# Altium schematic sheet MCU.SchDoc
size A4; SheetNumber: 1; SheetTotal: 3
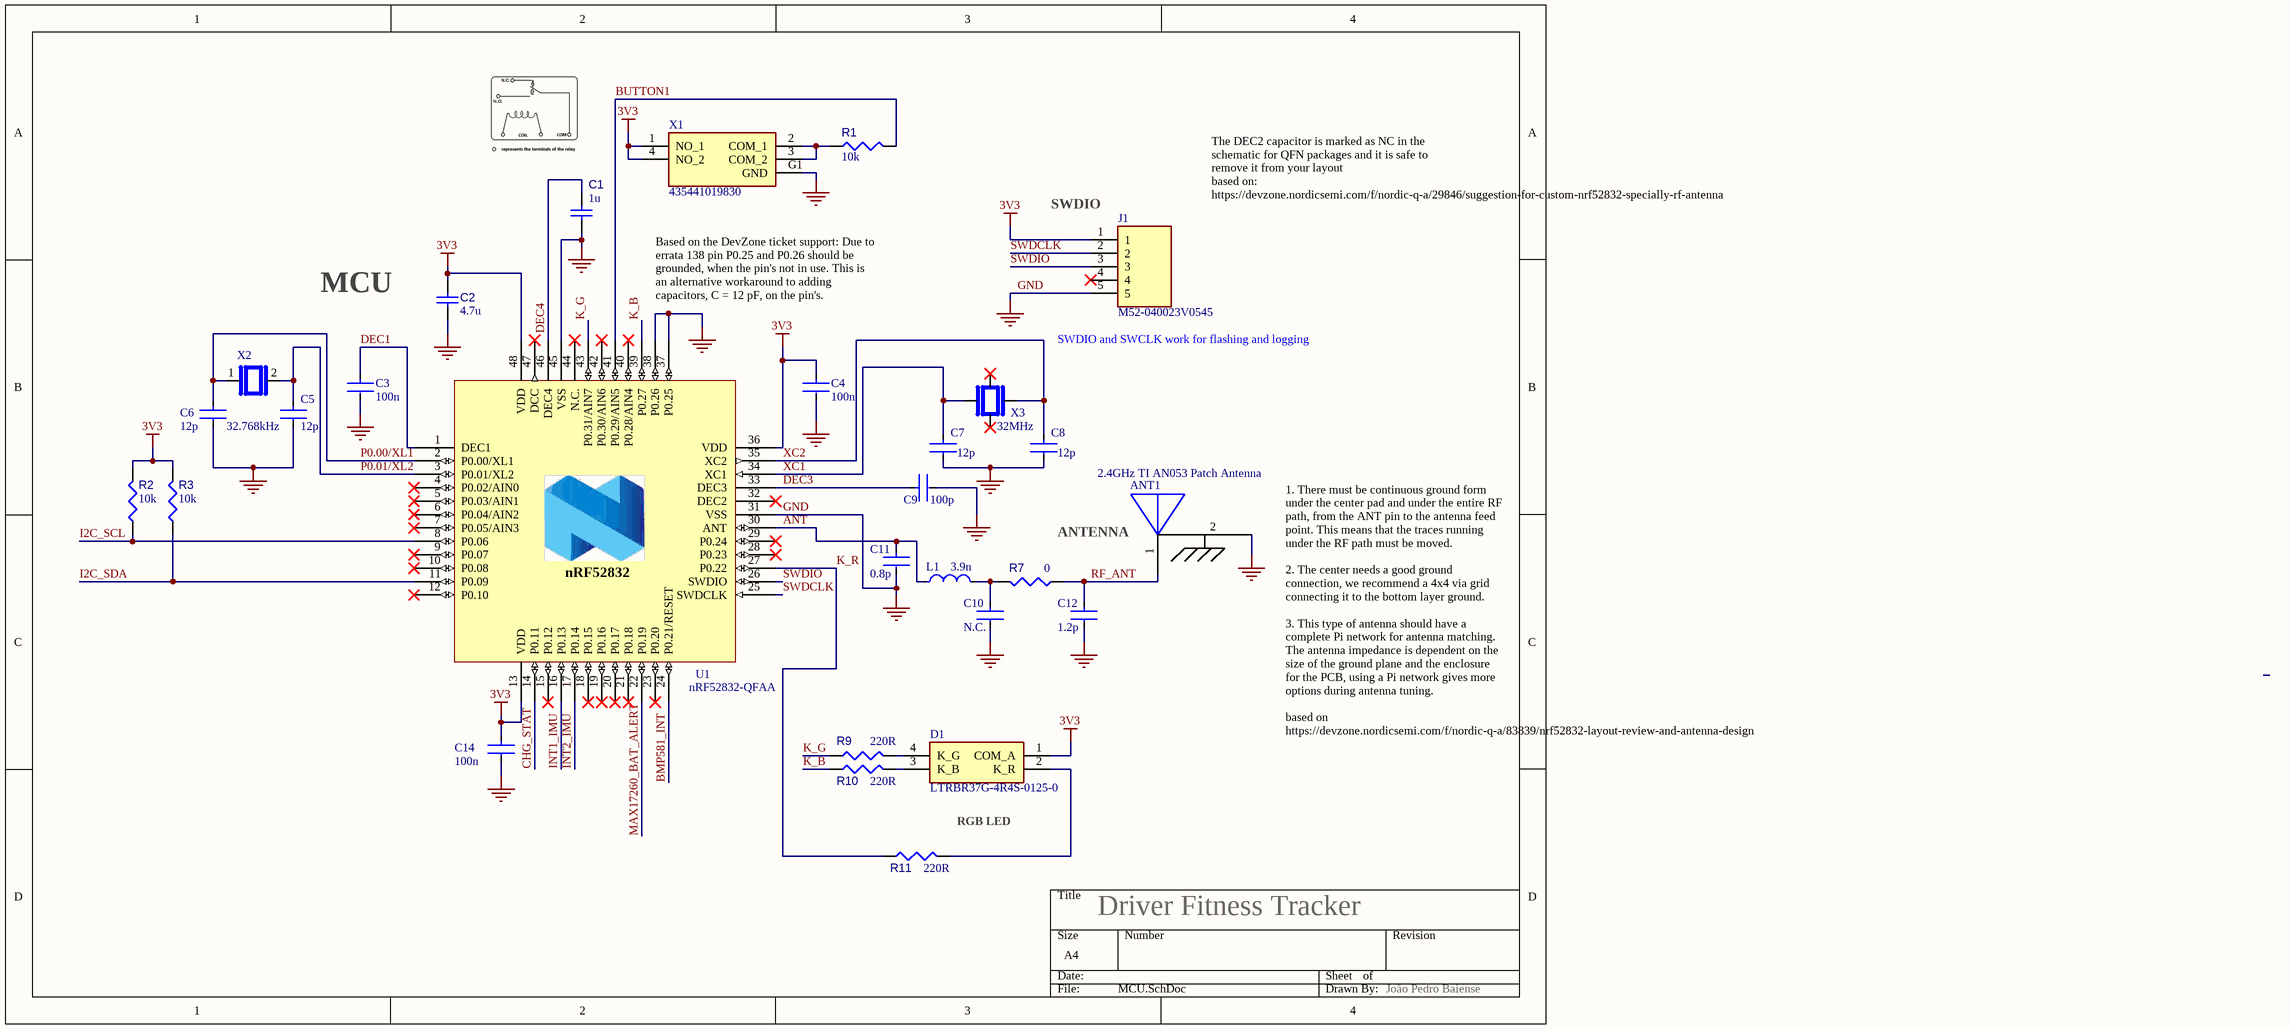
[diagram p0: MCU.SchDoc]

## Parts
ANT1  2.4GHz TI AN053 Patch Antenna  [2.4GHz TI AN053 Patch Antenna Right Original]  (no BOM)
C1  1u  [CAPC1608X90X40NL10T20]
C2  4.7u  [CAPC1608X90X40NL10T20]
C3  100n  [FP-C0402-BB-MFG]
C4  100n  [FP-C0402-BB-MFG]
C5  12p  [FP-C0402-BB-MFG]
C6  12p  [FP-C0402-BB-MFG]
C7  12p  [FP-C0402-BB-MFG]
C8  12p  [FP-C0402-BB-MFG]
C9  100p  [FP-C0402-BB-MFG]
C10  N.C.  [FP-C0402-BB-MFG]
C11  0.8p  [FP-C0402-BB-MFG]
C12  1.2p  [FP-C0402-BB-MFG]
C14  100n  [FP-C0402-BB-MFG]
D1  LTRBR37G-4R4S-0125-0  [RGBLED_LTRBR37G4R4S01250]
J1  M52-040023V0545  [5_PINS_HEADER_HDRV5W46P0X127_1X5_635X250X650P]
L1  3.9n  [FP-LQW15AN_00-W0_6-0_1-MFG]
R1  10k  [RESC0402(1005)_L]
R2  10k  [RESC0402(1005)_L]
R3  10k  [RESC0402(1005)_L]
R7  value 0  [RESC0402(1005)_L]  (hidden comment: 0R)
R9  220R  [RESC0402(1005)_L]
R10  220R  [RESC0402(1005)_L]
R11  220R  [RESC0402(1005)_L]
U1  nRF52832-QFAA  [QFN40P600X600X90-48N]
X1  435441019830  [BUTTON_435441019830]
X2  32.768kHz  [CRYSTAL_XTAL_CM8V-T1A-32.768KHZ-9PF-20PPM-TA-QC]
X3  32MHz  [OSC_XRCGB32M000F1H01R0]

## Nets
3V3: C2.1 C4.1 C14.1 D1.1(COM_A) J1.1 R2.2 R3.2 U1.13(VDD) U1.36(VDD) U1.48(VDD) X1.1(NO_1) X1.4(NO_2)
GND: ANT1.2 C1.2 C2.2 C3.2 C4.2 C5.2 C6.2 C7.2 C8.2 C9.2 C10.2 C11.2 C12.2 C14.2 J1.5 U1.31(VSS) U1.37(P0.25) U1.38(P0.26) U1.45(VSS) U1.49(GND) X1.G1(GND)
ANT: C11.1 L1.1 U1.30(ANT)
BMP581_INT: U1.24(P0.21/RESET)
BUTTON1: R1.2 U1.41(P0.29/AIN5)
CHG_STAT: U1.14(P0.11)
DEC1: C3.1 U1.1(DEC1)
DEC3: C9.1 U1.33(DEC3)
DEC4: C1.1 U1.46(DEC4)
I2C_SCL: R2.1 U1.8(P0.06)
I2C_SDA: R3.1 U1.11(P0.09)
INT1_IMU: U1.16(P0.13)
INT2_IMU: U1.17(P0.14)
K_B: R10.1 U1.39(P0.27)
K_G: R9.1 U1.43(P0.31/AIN7)
K_R: R11.1 U1.27(P0.22)
MAX17260_BAT_ALERT: U1.22(P0.19)
P0.00/XL1: C6.1 U1.2(P0.00/XL1) X2.1
P0.01/XL2: C5.1 U1.3(P0.01/XL2) X2.2
RF_ANT: ANT1.1(ANT) C12.1 R7.1
SWDCLK: J1.2 U1.25(SWDCLK)
SWDIO: J1.3 U1.26(SWDIO)
XC1: C7.1 U1.34(XC1) X3.1
XC2: C8.1 U1.35(XC2) X3.3
NetC10_1: C10.1 L1.2 R7.2
NetD1_2: D1.2(K_R) R11.2
NetD1_3: D1.3(K_B) R10.2
NetD1_4: D1.4(K_G) R9.2
NetR1_1: R1.1 X1.2(COM_1) X1.3(COM_2)

Not connected (* = marked no-connect by the designer): J1 4*; U1 4(P0.02/AIN0)* 5(P0.03/AIN1)* 6(P0.04/AIN2)* 7(P0.05/AIN3)* 9(P0.07)* 10(P0.08)* 12(P0.10)* 15(P0.12)* 18(P0.15)* 19(P0.16)* 20(P0.17)* 21(P0.18)* 23(P0.20)* 28(P0.23)* 29(P0.24)* 32(DEC2)* 40(P0.28/AIN4)* 42(P0.30/AIN6)* 44(N.C.)* 47(DCC)*; X3 2* 4*

## Notes on the sheet
- (near J1) SWDIO
- The DEC2 capacitor is marked as NC in the schematic for QFN packages and it is safe to remove it from your layout
  based on: https://devzone.nordicsemi.com/f/nordic-q-a/29846/suggestion-for-custom-nrf52832-specially-rf-antenna
- MCU
- Based on the DevZone ticket support: Due to errata 138 pin P0.25 and P0.26 should be grounded, when the pin's not in use. This is an alternative workaround to adding capacitors, C = 12 pF, on the pin's.
- (near J1) SWDIO and SWCLK work for flashing and logging
- ANTENNA
- 1. There must be continuous ground form under the center pad and under the entire RF path, from the ANT pin to the antenna feed point. This means that the traces running under the RF path must be moved.
  2. The center needs a good ground connection, we recommend a 4x4 via grid connecting it to the bottom layer ground.
  3. This type of antenna should have a complete Pi network for antenna matching. The antenna impedance is dependent on the size of the ground plane and the enclosure for the PCB, using a Pi network gives more options during antenna tuning.
  based on https://devzone.nordicsemi.com/f/nordic-q-a/83839/nrf52832-layout-review-and-antenna-design
- Type @ to refer to a designator or a net
- RGB LED
- Driver Fitness Tracker
- João Pedro Baiense
- (in symbol nRF52832_QFAA) nRF52832

## Library data of the parts
ANT1 = 2.4GHz Antenna with GND: From Application Note AN053
C1 = CMP-001-00017-6: Multilayer Ceramic Capacitors MLCC - SMD/SMT 50V 1uF X7R 0603 10%; CorrectManufacturer: 06035C105KAT2A; Tolerance: 10%; Voltage Rating: 50V; Mounting Technology: SM; Value: 1u; Max Operating Temperature: 125°C; RoHS Compliant: True; Pins: 2; Capacitor Type: Ceramic; Case/Package: 0603; Min Operating Temperature: -55°C; JLCPCB Part #: C15849
C2 = CMP-001-00017-6: Chip Capacitor, 100 nF, +/- 10%, 50 V, 0603 (1608 Metric); CorrectManufacturer: 0603YW475KAT2A; Voltage Rating: 50V; Capacitor Type: Ceramic; Tolerance: 10%; Mounting Technology: SM; Value: 4.7u; Max Operating Temperature: 125°C; RoHS Compliant: True; Pins: 2; Case/Package: 0603; Min Operating Temperature: -55°C; JLCPCB Part #: C14663
C3 C4 C14 = CMP-2008-02046-2: Multilayer Ceramic Capacitors MLCC - SMD/SMT NEW GLOBAL PN KGM05CR71H104KN 50V 0.1uF X7R 0402 10%; Manufacturer: Kemet; CorrectManufacturer: 04025C104KAT4A; Capacitance: 0.10 μF; Temperature Characteristic: X5R; Temperature Coefficient: 15%; Tolerance: 0.1; Voltage Rating: 10 V; Value: 0.10 μF; Material: Ceramic; Package: C0402-BB; Temperature: -55°C to +125°C; ComponentLink2Description: Datasheet; Device Class L1: Passive Components; Height: 0.55mm; Lead Free: Yes; ComponentLink2URL: https://content.kemet.com/datasheets/KEM_C1002_X7R_SMD.pdf; Device Class L2: Capacitors; Temperature Range Low: -55°C; Temperature Range High: +125°C; RoHS: TRUE; Octopart: https://octopart.com/c0402c104k8pactu-kemet-140039; Automotive: No; Mouser Description: Capacitor 100 nF 10 VDC 0402; Category: Cap; Digikey Description: CAP CER 0.1UF 10V X5R 0402; Ipc Land Pattern Name: CAPC10050X50; Device Class L3: Ceramic Capacitors; JLCPCB Part #: C1523
C5-C8 = CMP-2008-02046-2: Multilayer Ceramic Capacitors MLCC - SMD/SMT 12 pF 50 VDC 5% 0402 C0G (NP0); Manufacturer: Kemet; CorrectManufacturer: GRM1555C1H120JA01D; Capacitance: 0.10 μF; Temperature Characteristic: X5R; Temperature Coefficient: 15%; Tolerance: 0.1; Voltage Rating: 10 V; Value: 0.10 μF; Material: Ceramic; Package: C0402-BB; Temperature: -55°C to +125°C; ComponentLink2Description: Datasheet; Device Class L1: Passive Components; Height: 0.55mm; Lead Free: Yes; ComponentLink2URL: https://content.kemet.com/datasheets/KEM_C1002_X7R_SMD.pdf; Device Class L2: Capacitors; Temperature Range Low: -55°C; Temperature Range High: +125°C; RoHS: TRUE; Octopart: https://octopart.com/c0402c104k8pactu-kemet-140039; Automotive: No; Mouser Description: Capacitor 100 nF 10 VDC 0402; Category: Cap; Digikey Description: CAP CER 0.1UF 10V X5R 0402; Ipc Land Pattern Name: CAPC10050X50; Device Class L3: Ceramic Capacitors; JLCPCB Part #: C1547
C9 = CMP-2008-02046-2: Multilayer Ceramic Capacitors MLCC - SMD/SMT 100 pF 50 VDC 5% 0402 C0G (NP0); Manufacturer: Kemet; CorrectManufacturer: GRM1555C1H101JA01D; Capacitance: 0.10 μF; Temperature Characteristic: X5R; Temperature Coefficient: 15%; Tolerance: 0.1; Voltage Rating: 10 V; Value: 0.10 μF; Material: Ceramic; Package: C0402-BB; Temperature: -55°C to +125°C; ComponentLink2Description: Datasheet; Device Class L1: Passive Components; Height: 0.55mm; Lead Free: Yes; ComponentLink2URL: https://content.kemet.com/datasheets/KEM_C1002_X7R_SMD.pdf; Device Class L2: Capacitors; Temperature Range Low: -55°C; Temperature Range High: +125°C; RoHS: TRUE; Octopart: https://octopart.com/c0402c104k8pactu-kemet-140039; Automotive: No; Mouser Description: Capacitor 100 nF 10 VDC 0402; Category: Cap; Digikey Description: CAP CER 0.1UF 10V X5R 0402; Ipc Land Pattern Name: CAPC10050X50; Device Class L3: Ceramic Capacitors; JLCPCB Part #: C1546
C10 = CMP-2008-02046-2: DO NOT CONNECT THIS CAPACITOR - RF PURPOSE; CorrectManufacturer: NOT_CONNECT; ComponentLink2Description: Datasheet; ComponentLink2URL: https://content.kemet.com/datasheets/KEM_C1002_X7R_SMD.pdf
C11 = CMP-2008-02046-2: Multilayer Ceramic Capacitors MLCC - SMD/SMT 0.8 pF 50 VDC 0.05 pF 0402 C0G (NP0) AEC-Q200; Manufacturer: Murata Electronics; CorrectManufacturer: GCQ1555C1HR80WB01D; Capacitance: 0.10 μF; Temperature Characteristic: X5R; Temperature Coefficient: 15%; Tolerance: 0.1; Voltage Rating: 10 V; Material: Ceramic; Package: C0402-BB; Temperature: -55°C to +125°C; ComponentLink2Description: Datasheet; Device Class L1: Passive Components; Height: 0.55mm; Lead Free: Yes; ComponentLink2URL: https://content.kemet.com/datasheets/KEM_C1002_X7R_SMD.pdf; Device Class L2: Capacitors; Temperature Range Low: -55°C; Temperature Range High: +125°C; RoHS: TRUE; Octopart: https://octopart.com/c0402c104k8pactu-kemet-140039; Automotive: No; Mouser Description: Capacitor 100 nF 10 VDC 0402; Category: Cap; Digikey Description: CAP CER 0.1UF 10V X5R 0402; Ipc Land Pattern Name: CAPC10050X50; Device Class L3: Ceramic Capacitors; JLCPCB Part #: C172820
C12 = CMP-2008-02046-2: Multilayer Ceramic Capacitors MLCC - SMD/SMT NEW GLOBAL PN KGM05ACG1H1R2BN 50V 1.2pF C0G 0402 .1pF Tol; Manufacturer: Kemet; CorrectManufacturer: 04025A1R2BAT4A; Capacitance: 0.10 μF; Temperature Characteristic: X5R; Temperature Coefficient: 15%; Tolerance: 0.1; Voltage Rating: 10 V; Value: 0.10 μF; Material: Ceramic; Package: C0402-BB; Temperature: -55°C to +125°C; ComponentLink2Description: Datasheet; Device Class L1: Passive Components; Height: 0.55mm; Lead Free: Yes; ComponentLink2URL: https://content.kemet.com/datasheets/KEM_C1002_X7R_SMD.pdf; Device Class L2: Capacitors; Temperature Range Low: -55°C; Temperature Range High: +125°C; RoHS: TRUE; Octopart: https://octopart.com/c0402c104k8pactu-kemet-140039; Automotive: No; Mouser Description: Capacitor 100 nF 10 VDC 0402; Category: Cap; Digikey Description: CAP CER 0.1UF 10V X5R 0402; Ipc Land Pattern Name: CAPC10050X50; Device Class L3: Ceramic Capacitors; JLCPCB Part #: C76955
D1 = RGBLED_LTRBR37G-4R4S-0125-0: Standard LEDs - SMD LTRBR37G; Manufacturer_Name: ams OSRAM; Geometry.Height: 0.35mm; Mouser Part Number: 720-LTRBR37GA6714; Mouser Price/Stock: https://www.mouser.co.uk/ProductDetail/ams-OSRAM/LTRBR37G-4R4S-0125-0?qs=vvQtp7zwQdPO5tl4HQ7ftA%3D%3D; CorrectManufacturer: LTRBR37G-4R4S-0125-0; Datasheet Link: https://dammedia.osram.info/media/resource/hires/osram-dam-24639129/LTRB%20R37G_EN.pdf
J1 = 5_PINS_HEADER_M52-040023V0545: Headers & Wire Housings Pin1.27mm Tail,Vert SIL, 5P, Single Row; Manufacturer_Name: Harwin; Geometry.Height: 6.5mm; CorrectManufacturer: M52-040023V0545; Mouser Part Number: 855-M52-040023V0545; Mouser Price/Stock: https://www.mouser.co.uk/ProductDetail/Harwin/M52-040023V0545?qs=wuXwK9wHm9ubXDya5zRNiw%3D%3D; Arrow Part Number: *; Arrow Price/Stock: *; Datasheet Link: https://cdn.harwin.com/pdfs/M52-040023VXX45.pdf
L1 = CMP-06042-000827-1: RF Inductors - SMD 01005, 3.9nH +-0.2nH S-HQ SMD RF IND; CorrectManufacturer: MHQ0402PSA3N9CT000; Shielding: Unshielded; Self Resonant Frequency: 10GHz; Core Material: Air; Current: 750mA; Test Frequency: 100MHz; DC Resistance (DCR): 70mR; Length: 1mm; Inductance: 3.9nH; Height: 0.5mm; Case Code (Metric): 1005; Lead Free: Lead Free; Military Standard: Not; Mount: Surface Mount; REACH SVHC: No SVHC; Current Rating: 750mA; DC Current: 750mA; Max Operating Temperature: 125°C; Package Quantity: 10000; Packaging: Tape and Reel; Case/Package: 0402; Min Operating Temperature: -55°C; Width: 0.02inch; Depth: 0.7mm; Termination: SMD/SMT; Weight: 2.8E-05oz; Number of Pins: 2; Radiation Hardening: No; Max DC Current: 750mA; JLCPCB Part #: C14033
R1-R3 = CMP-009-00149-3: Thin Film Resistors - SMD 1/16W 10K ohm 1% 50ppm; CorrectManufacturer: RT0402FRE0710KL; Power: 63mW; Min Operating Temperature: -55°C; Tolerance: 1%; Case/Package: 0402; Max Operating Temperature: 155°C; Value: 10k; Pins: 2; JLCPCB Part #: C25744
R7 = CMP-009-00149-3: Thin Film Resistors - SMD MCS 0402 VG01 E1 0R0; CorrectManufacturer: MCS0402HZ0000ZE100; Power: 63mW; Tolerance: 1%; Min Operating Temperature: -55°C; Case/Package: 0402; Max Operating Temperature: 155°C; Pins: 2
R9-R11 = CMP-009-00149-3: Thin Film Resistors - SMD .063W 220ohms 1% 0402 50ppm; CorrectManufacturer: MCS04020C2200FE000; Power: 63mW; Min Operating Temperature: -55°C; Tolerance: 1%; Case/Package: 0402; Max Operating Temperature: 155°C; Value: 220R; Pins: 2; JLCPCB Part #: C25744
U1 = nRF52832_QFAA: Multi-protocol Bluetooth Low Energy, ANT and 2.4GHz proprietary system-on-chip; Manufacturer: Nordic Semiconductor; CorrectManufacturer: nRF52832-QFAA-R; Artikkelnr Noca: N.A.; Part Number: nRF52832-QFAA; Datasheet: *; LatestRevisionDate: 2014-11-26; Pin Count: 48; Publisher: Nordic Semiconductor; Published: 2014-11-26; Value: nRF52832-QFAA; Note: *; Supplier: Nordic Semiconductor; Supplier part number: *; 2nd source Supplier: *; 2nd source part number: *; Footprint Doc: QFN-48; Artikkelnr Simpro: N.A.; JLCPCB Link: https://jlcpcb.com/partdetail/NordicSemicon-NRF52832_QFAAR/C77540; JLCPCB Part #: C77540
X1 = BUTTON_435441019830: Tactile Switches WS-TASV Tact Switch Washable 4.1x2.8x1.9 mm SMT; Manufacturer_Name: Wurth Elektronik; Geometry.Height: 1.9mm; Mouser Part Number: 710-435441019830; Mouser Price/Stock: https://www.mouser.co.uk/ProductDetail/Wurth-Elektronik/435441019830?qs=ufv2HEpFn%252BQgnhl%2FsZ0Vfw%3D%3D; CorrectManufacturer: 435441019830; Datasheet Link: https://www.we-online.com/catalog/datasheet/435441019830.pdf
X2 = CRYSTAL_32K: Crystals 32.768 kHz 9.0 pF +/-20 PPM -40/+85C; CorrectManufacturer: CM8V-T1A-32.768KHZ-9PF-20PPM-TA-QC; MF: Micro Crystal; SnapEDA_Link: https://www.snapeda.com/parts/CM8V-T1A-32.768KHZ-9PF-20PPM-TA-QC/Micro+Crystal/view-part/?ref=snap; Package: SMD-2 Micro Crystal; Value: *; Check_prices: https://www.snapeda.com/parts/CM8V-T1A-32.768KHZ-9PF-20PPM-TA-QC/Micro+Crystal/view-part/?ref=eda
X3 = XRCGB32M000F1H01R0: Crystals 32 MHZ 10PPM 2.0X1.6X; is Basic Part?: No; MF: Murata Electronics; Package: SMD-4 Murata; Availability: In Stock; Value: *; CorrectManufacturer: XRCGB32M000F1H01R0; Purchase-URL: https://pricing.snapeda.com/search/part/XRCGB32M000F1H01R0/?ref=eda; Check_prices: https://www.snapeda.com/parts/XRCGB32M000F1H01R0/Murata/view-part/?ref=eda; Price: None; SnapEDA_Link: https://www.snapeda.com/parts/XRCGB32M000F1H01R0/Murata/view-part/?ref=snap; Available at JLCPCB?: Yes; JLCPCB Link: https://jlcpcb.com/partdetail/985230-XRCGB32M000F1H01R0/C914155; JLCPCB Part #: C914155